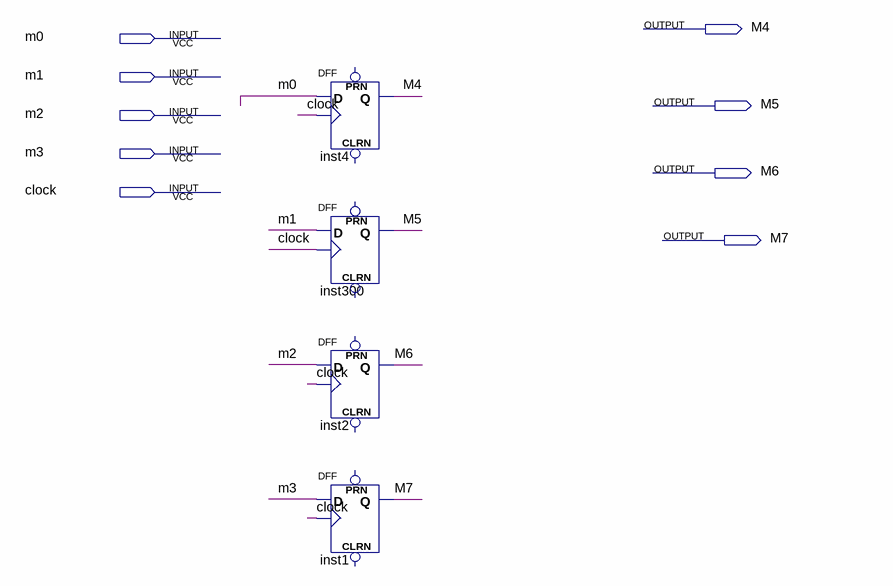
[diagram p0: schematic sheet]
// Quartus schematic eslesmeRegister.bdf as structural Verilog: 4 symbols, 9 pins
module eslesmeRegister (
  input  m0,
  input  m1,
  input  m2,
  input  m3,
  input  clock,
  output M4,
  output M5,
  output M6,
  output M7
);

  DFF inst4 (.CLK(clock), .D(m0), .Q(M4));  // open: CLRN, PRN
  DFF inst300 (.CLK(clock), .D(m1), .Q(M5));  // open: CLRN, PRN
  DFF inst2 (.CLK(clock), .D(m2), .Q(M6));  // open: CLRN, PRN
  DFF inst1 (.CLK(clock), .D(m3), .Q(M7));  // open: CLRN, PRN
endmodule
